# EAGLE design canable (EAGLE 6.6.0)
Therm
CNAME: CANable USB<=>CAN / FabLab Karlsruhe MOD; CREVISION: 0.1; DESIGNER: Ethan Zonca
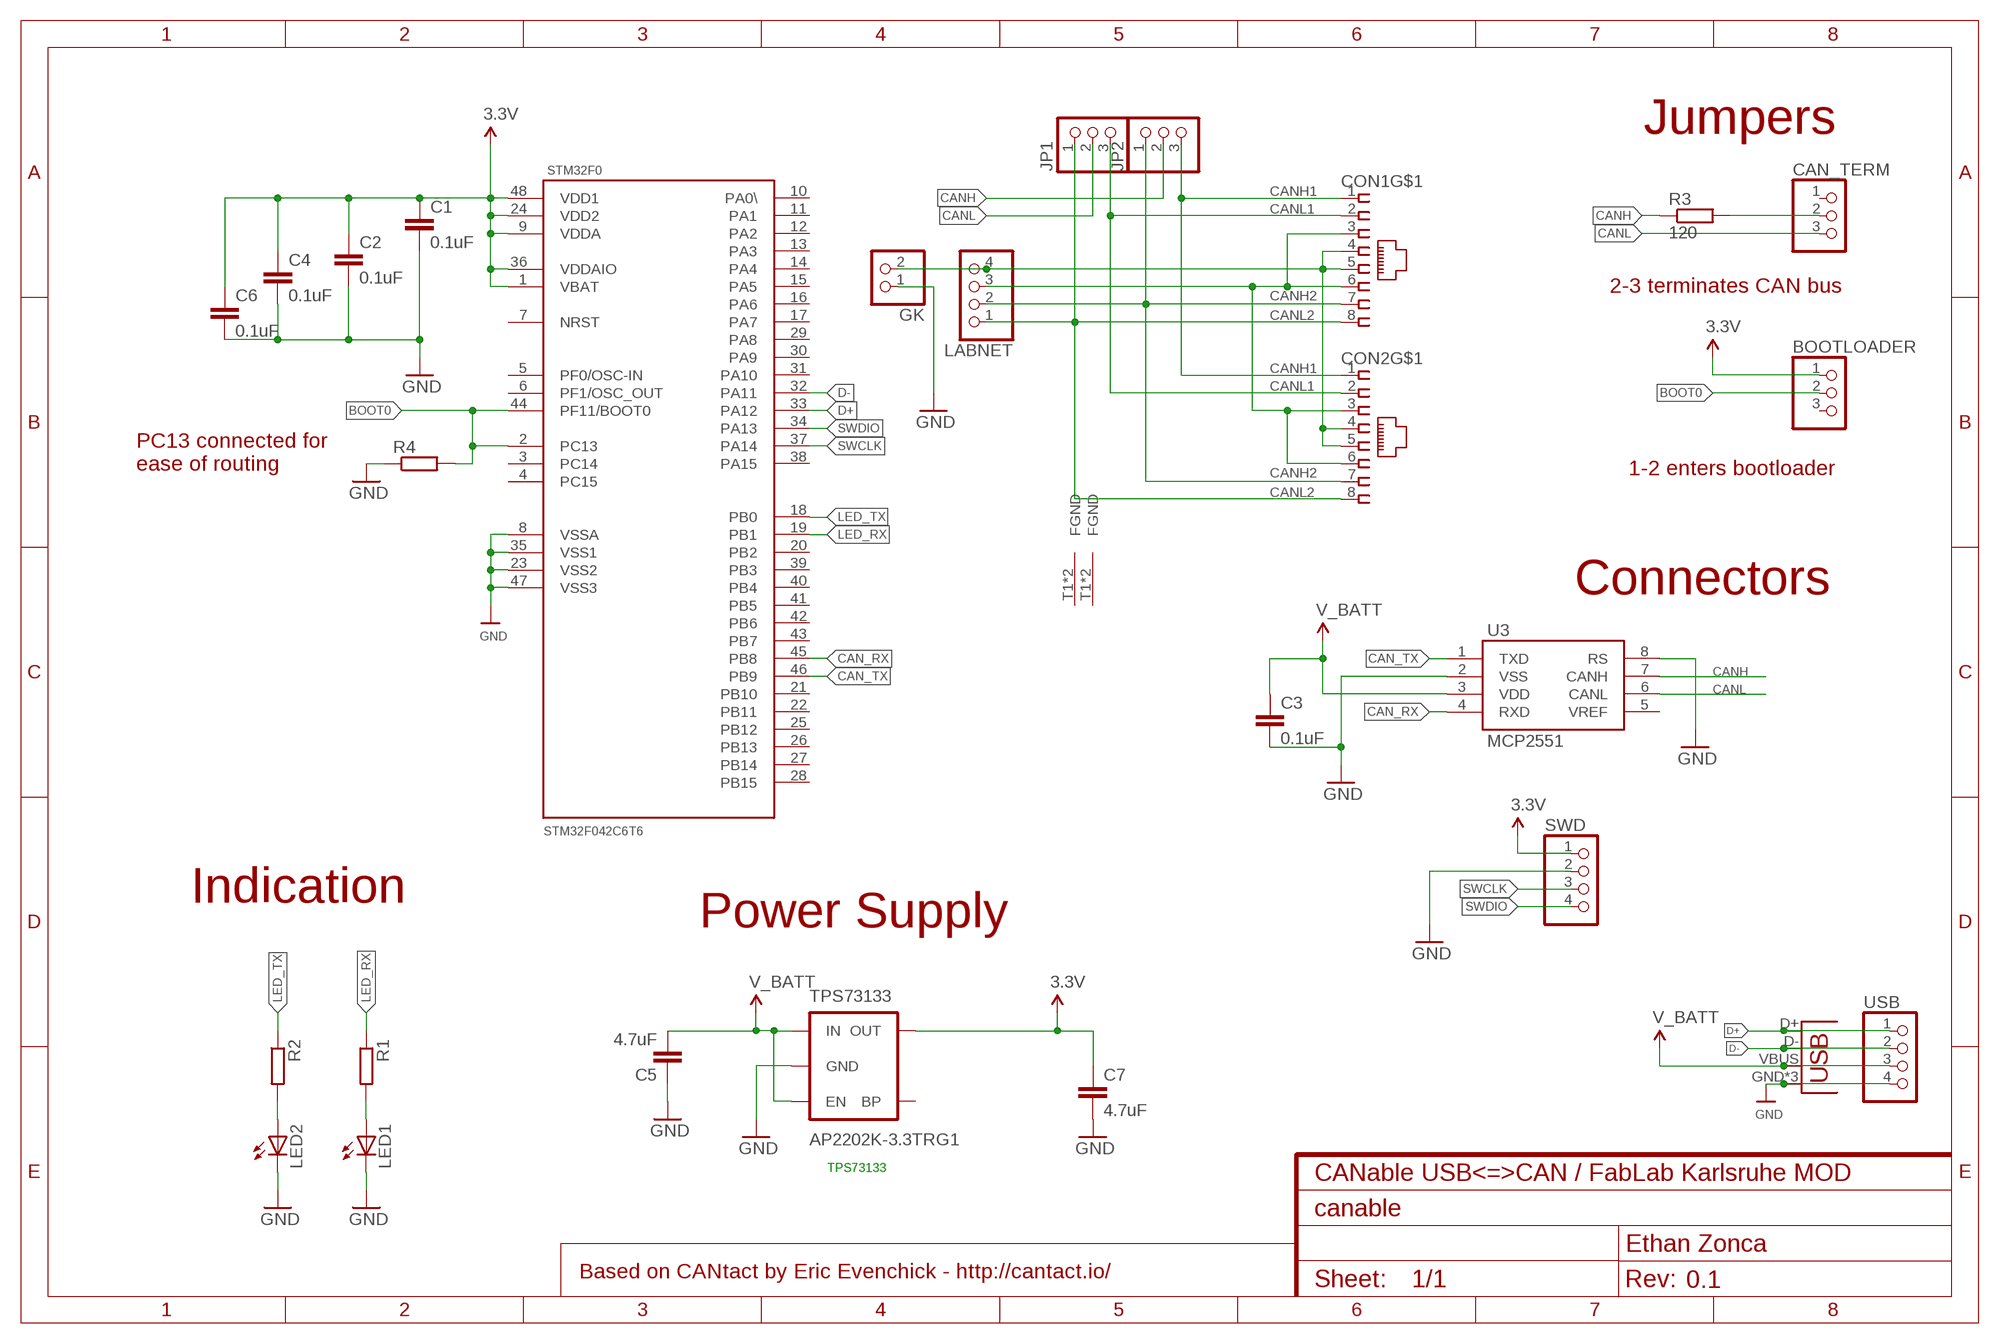
[diagram p0: schematic, sheet 1]

## Parts
BOOTLOADER  PINHD-1X3  [1X03]
C1  0.1uF  C-EUC0805  [C0805]
C2  0.1uF  C-EUC0805  [C0805]
C3  0.1uF  C-EUC0805  [C0805]
C4  0.1uF  C-EUC0805  [C0805]
C5  4.7uF  C-EUC0805  [C0805]
C6  0.1uF  C-EUC0805  [C0805]
C7  4.7uF  C-EUC0805  [C0805]
CAN_TERM  PINHD-1X3  [1X03]
CON1  MEBP_8-8G  [MEBP]
CON2  MEBP_8-8G  [MEBP]
GK  PINHD-1X2  [1X02]
J2  USB-MICROB  [USB-MICROB]
JP1  PINHD-1X3  [1X03]
JP2  PINHD-1X3  [1X03]
LABNET  PINHD-1X4  [1X04]
LED1  LEDCHIPLED_1206  [CHIPLED_1206]
LED2  LEDCHIPLED_1206  [CHIPLED_1206]
R1  R-EU_R0805  [R0805]
R2  R-EU_R0805  [R0805]
R3  120  R-EU_R0805  [R0805]
R4  R-EU_R0805  [R0805]
STM32F0  STM32F042C6T6  [LQFP48]
SWD  PINHD-1X4  [1X04]
TPS73133  AP2202K-3.3TRG1  MIC52053.3V  [SOT23-5]
U3  MCP2551  [SO08]
USB  PINHD-1X4  [1X04]

## Nets
3.3V: BOOTLOADER.1 C1.1 C2.1 C4.1 C6.1 C7.1 STM32F0.1(VBAT) STM32F0.9(VDDA) STM32F0.24(VDD2) STM32F0.36(VDDAIO) STM32F0.48(VDD1) SWD.1 TPS73133.5(OUT)
BOOT0: BOOTLOADER.2 R4.2 STM32F0.2(PC13) STM32F0.44(PF11/BOOT0)
CAN_RX: STM32F0.45(PB8) U3.4(RXD)
CAN_TX: STM32F0.46(PB9) U3.1(TXD)
CANH: JP2.2 R3.1 U3.7(CANH)
CANH1: CON1.1 CON2.1 JP2.3
CANH2: CON1.7 CON2.7 JP2.1 LABNET.2
CANL: CAN_TERM.3 JP1.2 U3.6(CANL)
CANL1: CON1.2 CON2.2 JP1.3
CANL2: CON1.8 CON2.8 JP1.1 LABNET.1
D+: J2.D+ STM32F0.33(PA12) USB.1
D-: J2.D- STM32F0.32(PA11) USB.2
GND: C1.2 C2.2 C3.2 C4.2 C5.1 C6.2 C7.2 GK.1 J2.GND J2.MT1(GND) J2.MT2(GND) LED1.C LED2.C R4.1 STM32F0.8(VSSA) STM32F0.23(VSS2) STM32F0.35(VSS1) STM32F0.47(VSS3) SWD.2 TPS73133.2(GND) U3.2(VSS) U3.8(RS) USB.4
LED_RX: R1.1 STM32F0.19(PB1)
LED_TX: R2.1 STM32F0.18(PB0)
N$2: LED2.A R2.2
N$3: CAN_TERM.2 R3.2
N$5: CON1.3 CON1.6 CON2.3 CON2.6 LABNET.3
N$6: CON1.4 CON1.5 CON2.4 CON2.5 GK.2 LABNET.4
N$23: LED1.A R1.2
SWCLK: STM32F0.37(PA14) SWD.3
SWDIO: STM32F0.34(PA13) SWD.4
V_BATT: C3.1 C5.2 J2.VBUS TPS73133.1(IN) TPS73133.3(EN) U3.3(VDD) USB.3
Unconnected: BOOTLOADER.3 CAN_TERM.1 STM32F0.3(PC14) STM32F0.4(PC15) STM32F0.5(PF0/OSC-IN) STM32F0.6(PF1/OSC_OUT) STM32F0.7(NRST) STM32F0.10(PA0\) STM32F0.11(PA1) STM32F0.12(PA2) STM32F0.13(PA3) STM32F0.14(PA4) STM32F0.15(PA5) STM32F0.16(PA6) STM32F0.17(PA7) STM32F0.20(PB2) STM32F0.21(PB10) STM32F0.22(PB11) STM32F0.25(PB12) STM32F0.26(PB13) STM32F0.27(PB14) STM32F0.28(PB15) STM32F0.29(PA8) STM32F0.30(PA9) STM32F0.31(PA10) STM32F0.38(PA15) STM32F0.39(PB3) STM32F0.40(PB4) STM32F0.41(PB5) STM32F0.42(PB6) STM32F0.43(PB7) TPS73133.4(BP) U3.5(VREF)

## Notes on the sheet
- Jumpers
- 2-3 terminates CAN bus
- 1-2 enters bootloader
- PC13 connected for
  ease of routing
- Connectors
- Indication
- Power Supply
- TPS73133
- Based on CANtact by Eric Evenchick - http://cantact.io/

## Power pins joined to a net without a drawn wire
FGND: CON1.T1(FGND) CON1.T2(FGND) CON2.T1(FGND) CON2.T2(FGND)

## Library data of the parts
BOOTLOADER CAN_TERM JP1 JP2 = pinhead:PINHD-1X3: PIN HEADER
C1-C7 = schlager_passiv:C-EU: CAPACITOR, European symbol
CON1 CON2 = schlager_con:MEBP_8-8G: Reichelt RJ45 geschirmt MEBP 8-8G
GK = pinhead:PINHD-1X2: PIN HEADER
J2 = SparkFun-Connectors:USB: USB Connectors USB-B-PTH is fully proven SKU : PRT-00139/CONN-08278 USB-miniB is fully proven SKU : PRT-00587 USB-A-PCB is untested. USB-A-H is throughly reviewed, but untested. Spark Fun Electronics SKU : PRT-00437 USB-B-SMT is throughly reviewed, but untested. Needs silkscreen touching up. USB-A-S has not been used/tested USB-MB-H has not been used/tested USB-MICROB has been used. CONN-09505; PROD_ID: CONN-09505
LABNET SWD USB = pinhead:PINHD-1X4: PIN HEADER
LED1 LED2 = led:LED: LED OSRAM: - CHIPLED LG R971, LG N971, LY N971, LG Q971, LY Q971, LO R971, LY R971 LH N974, LH R974 LS Q976, LO Q976, LY Q976 LO Q996 - Hyper CHIPLED LW Q18S LB Q993, LB Q99A, LB R99A - SideLED LS A670, LO A670, LY A670, LG A670, LP A670 LB A673, LV A673, LT A673, LW A673 LH A674 LY A675 LS A676, LA A676, LO A676, LY A676, LW A676 LS A679, LY A679, LG A679 - Hyper Micro SIDELED® LS Y876, LA Y876, LO Y876, LY Y876 LT Y87S - SmartLED LW L88C, LW L88S LB L89C, LB L89S, LG L890 LS L89K, LO L89K, LY L89K LS L896, LA L896, LO L896, LY L896 - TOPLED LS T670, LO T670, LY T670, LG T670, LP T670 LSG T670, LSP T670, LSY T670, LOP T670, LYG T670 LG T671, LOG T671, LSG T671 LB T673, LV T673, LT T673, LW T673 LH T674 LS T676, LA T676, LO T676, LY T676, LB T676, LH T676, LSB T676, LW T676 LB T67C, LV T67C, LT T67C, LS T67K, LO T67K, LY T67K, LW E67C LS E67B, LA E67B, LO E67B, LY E67B, LB E67C, LV E67C, LT E67C LW T67C LS T679, LY T679, LG T679 LS T770, LO T770, LY T770, LG T770, LP T770 LB T773, LV T773, LT T773, LW T773 LH T774 LS E675, LA E675, LY E675, LS T675 LS T776, LA T776, LO T776, LY T776, LB T776 LHGB T686 LT T68C, LB T68C - Hyper Mini TOPLED® LB M676 - Mini TOPLED Santana® LG M470 LS M47K, LO M47K, LY M47K Source: http://www.osram.convergy.de LUXEON: - LUMILED® LXK2-PW12-R00, LXK2-PW12-S00, LXK2-PW14-U00, LXK2-PW14-V00 LXK2-PM12-R00, LXK2-PM12-S00, LXK2-PM14-U00 LXK2-PE12-Q00, LXK2-PE12-R00, LXK2-PE12-S00, LXK2-PE14-T00, LXK2-PE14-U00 LXK2-PB12-K00, LXK2-PB12-L00, LXK2-PB12-M00, LXK2-PB14-N00, LXK2-PB14-P00, LXK2-PB14-Q00 LXK2-PR12-L00, LXK2-PR12-M00, LXK2-PR14-Q00, LXK2-PR14-R00 LXK2-PD12-Q00, LXK2-PD12-R00, LXK2-PD12-S00 LXK2-PH12-R00, LXK2-PH12-S00 LXK2-PL12-P00, LXK2-PL12-Q00, LXK2-PL12-R00 Source: www.luxeon.com KINGBRIGHT: KA-3528ASYC Source: www.kingbright.com
R1-R4 = schlager_passiv:R-EU_: RESISTOR, European symbol
STM32F0 = Protofusion:STM32F042C6T6
TPS73133 = SparkFun-PowerIC:MIC5205: MIC5205 150mA vreg 3.3V - VREG-00822 5V - VREG-00823; PROD_ID: VREG-00822
U3 = SparkFun-DigitalIC:MCP2551: CAN transceiver; PROD_ID: IC-09907

## Board
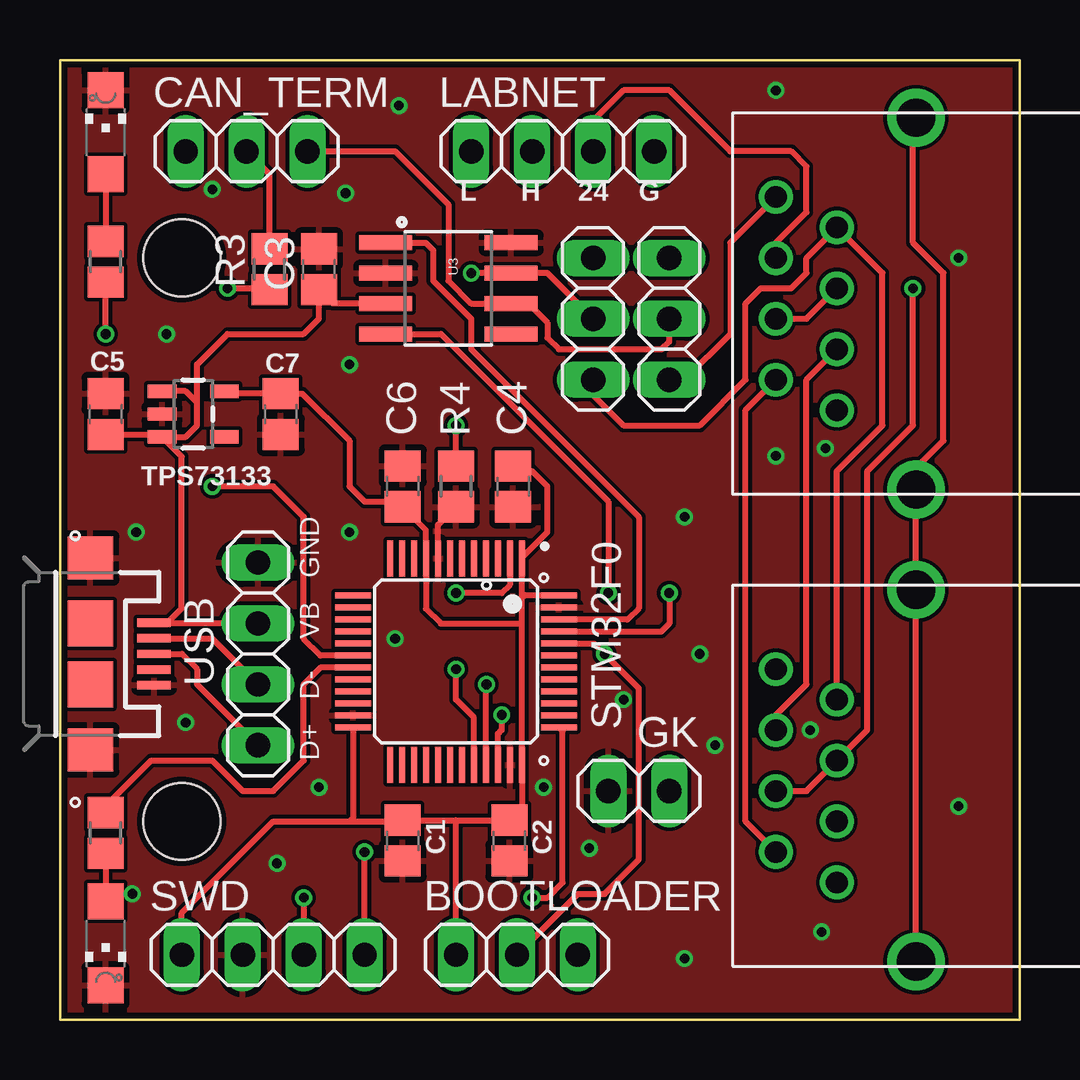
[diagram p1: board, top side]
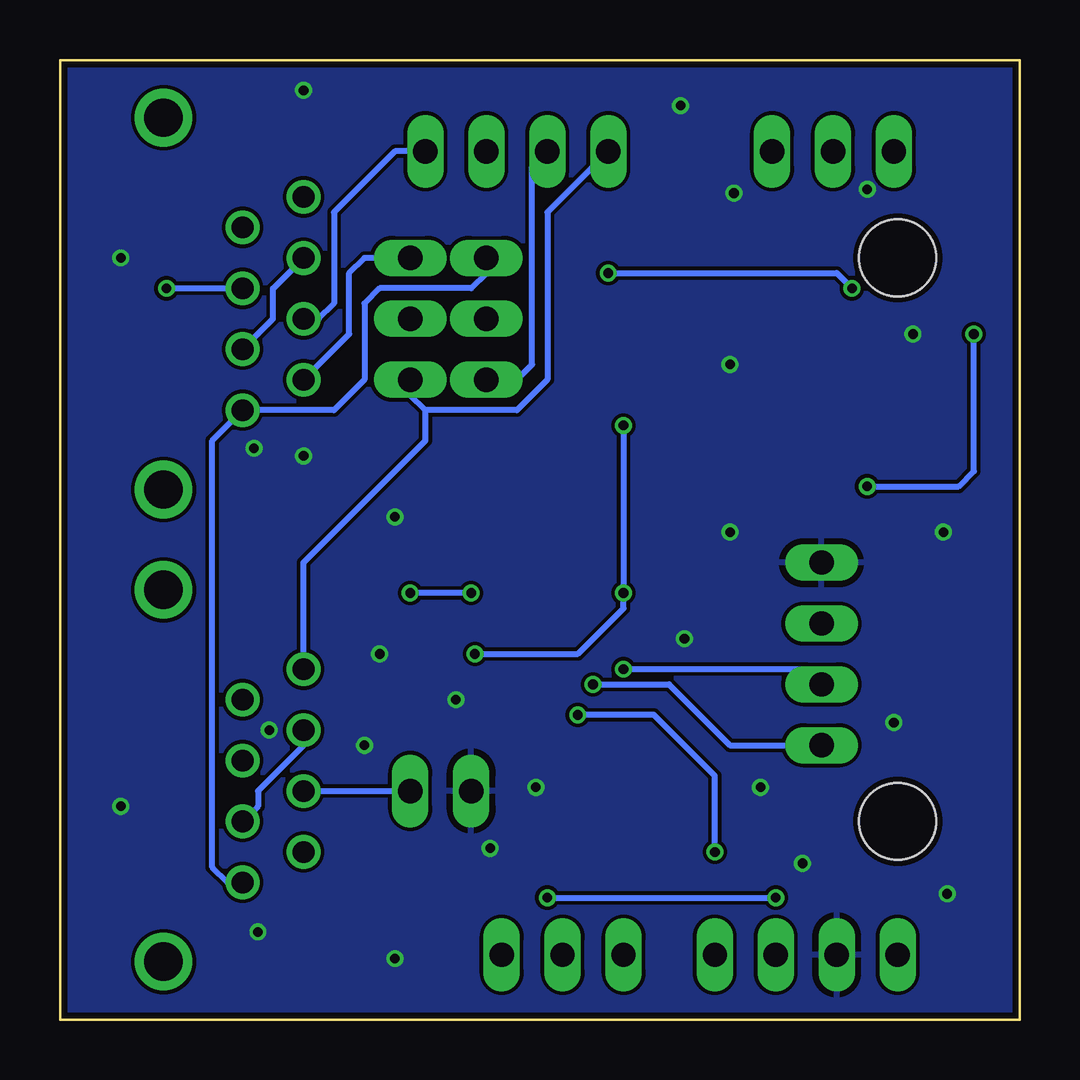
[diagram p2: board, bottom side, seen from below]

Size 40 x 40 mm. Coordinates in mm from the lower left corner, seen from the top.
Outline: 0,0 0,40 40,40 40,0 0,0
Copper layers (1*16): Top 0.035mm / dielectric 1.5mm / Bottom 0.035mm
Design rules "Elecrow_2-layer_eagle_rule *": minimum track width 6mil, minimum drill 12mil, track to track 6mil, track to pad 6mil, pad to pad 6mil, via to via 6mil, smd to smd 0mil, copper to edge 10mil, drill to drill 10mil, minimum pad ring 10mil, minimum via ring 6mil, stop-mask expansion 2mil, vias tented up to drill 100mil, thermal gap 10mil
Holes 3.2 mm at 5.08,31.75 5.08,8.26

### Footprints (pad centres in the part's own frame; a part is rotated, then mirrored left to right if it is on the bottom)
1X03 = drill 1.016 long: 1 -2.54,0; 2 0,0; 3 2.54,0
C0805 = smd 1.3 x 1.5: 1 -0.85,0; 2 0.85,0
MEBP = drill 0.9: 1 -4.445,6.35; 2 -3.175,8.89; 3 -1.9,6.35; 4 -0.635,8.89; 5 0.635,6.35; 6 1.9,8.89; 7 3.175,6.35; 8 4.445,8.89 | drill 1.6: T1 -7.75,3.05; T2 7.75,3.05
1X02 = drill 1.016 long: 1 -1.27,0; 2 1.27,0
USB-MICROB = smd 0.35 x 1.4: D+ 0,2.65; D- -0.65,2.65; GND 1.3,2.65; ID 0.65,2.65; VBUS -1.3,2.65 | smd 1.8 x 1.9: MT1 -4,0; MT2 4,0 | smd 1.9 x 1.9: P$1 -1.27,0; P$2 1.27,0
1X04 = drill 1.016 long: 1 -3.81,0; 2 -1.27,0; 3 1.27,0; 4 3.81,0
CHIPLED_1206 = smd 1.5 x 1.5: A 0,-1.75; C 0,1.75
R0805 = smd 1.3 x 1.5: 1 -0.85,0; 2 0.85,0
LQFP48 = smd 1.5 x 0.25: 1 -4.3,2.75; 2 -4.3,2.25; 3 -4.3,1.75; 4 -4.3,1.25; 5 -4.3,0.75; 6 -4.3,0.25; 7 -4.3,-0.25; 8 -4.3,-0.75; 9 -4.3,-1.25; 10 -4.3,-1.75; 11 -4.3,-2.25; 12 -4.3,-2.75; 25 4.3,-2.75; 26 4.3,-2.25; 27 4.3,-1.75; 28 4.3,-1.25; 29 4.3,-0.75; 30 4.3,-0.25; 31 4.3,0.25; 32 4.3,0.75; 33 4.3,1.25; 34 4.3,1.75; 35 4.3,2.25; 36 4.3,2.75 | smd 0.25 x 1.5: 13 -2.75,-4.3; 14 -2.25,-4.3; 15 -1.75,-4.3; 16 -1.25,-4.3; 17 -0.75,-4.3; 18 -0.25,-4.3; 19 0.25,-4.3; 20 0.75,-4.3; 21 1.25,-4.3; 22 1.75,-4.3; 23 2.25,-4.3; 24 2.75,-4.3; 37 2.75,4.3; 38 2.25,4.3; 39 1.75,4.3; 40 1.25,4.3; 41 0.75,4.3; 42 0.25,4.3; 43 -0.25,4.3; 44 -0.75,4.3; 45 -1.25,4.3; 46 -1.75,4.3; 47 -2.25,4.3; 48 -2.75,4.3
SOT23-5 = smd 0.55 x 1.2: 1 -0.95,-1.3; 2 0,-1.3; 3 0.95,-1.3; 4 0.95,1.3; 5 -0.95,1.3
SO08 = smd 0.61 x 2.21: 1 -1.905,-2.616; 2 -0.635,-2.616; 3 0.635,-2.616; 4 1.905,-2.616; 5 1.905,2.616; 6 0.635,2.616; 7 -0.635,2.616; 8 -1.905,2.616

### Placement (x,y rotation side)
BOOTLOADER  19.05,2.7 0 top
C1  14.29,7.46 270 top
C2  18.73,7.46 270 top
C3  10.79,31.27 90 top
C4  18.89,22.23 270 top
C5  1.91,25.24 270 top
C6  14.29,22.23 90 top
C7  9.21,25.24 270 top
CAN_TERM  7.78,36.2 0 top
CON1  38.73,29.84 90 top
CON2  38.73,10.16 90 top
GK  24.13,9.53 0 top
J2  1.27,15.24 270 top
JP1  25.4,29.21 90 top
JP2  22.23,29.21 90 top
LABNET  20.95,36.2 0 top
LED1  1.91,3.17 180 top
LED2  1.91,36.99 0 top
R1  1.91,7.78 270 top
R2  1.91,31.59 90 top
R3  8.73,31.27 90 top
R4  16.51,22.23 90 top
STM32F0  16.51,14.92 270 top
SWD  8.89,2.7 0 top
TPS73133  5.56,25.24 270 top
U3  16.19,30.48 270 top
USB  8.26,15.24 90 top

### Tracks (layer width: path | path; a pad name or v marks a point on that pad's centre or on a via)
3.3V
  Top 0.254: SWD.1 5.08,4.45 8.89,8.26 12.06,8.26 | 12.06,8.26 14.23,8.26 C1.1 16.51,8.31 | 16.51,8.31 C2.1 19.26,8.84 STM32F0.36 19.26,16.51 | STM32F0.24 12.21,8.4 12.06,8.26 | BOOTLOADER.1 16.51,8.31 | 19.26,16.51 19.26,17.78 | 19.26,17.78 STM32F0.1 19.26,19.26 20.32,20.32 20.32,22.23 19.68,22.86 19.11,22.86 C4.1 | 19.26,16.51 15.88,16.51 15.26,17.12 STM32F0.9 15.26,20.4 C6.1 14.07,21.59 12.7,21.59 12.06,22.23 12.06,24.13 10.1,26.09 C7.1 6.96,26.09 TPS73133.5 | STM32F0.48 19.37,17.67 19.26,17.78
BOOT0  (via drill 0.4)
  Top 0.254: R4.2 v16.51,24.77 | STM32F0.2 18.76,18.12 18.41,17.78 v16.51,17.78 | STM32F0.44 22.27,15.67 v22.7,15.24 24.13,13.81 24.13,6.67 22.7,5.24 21.59,5.24 BOOTLOADER.2
  Bottom 0.254: v16.51,24.77 v16.51,17.78 16.51,17.14 18.41,15.24 v22.7,15.24
CAN_RX  (via drill 0.4)
  Top 0.254: U3.4 15.88,28.57 22.86,21.59 v22.86,17.78 | v25.4,17.78 25.4,16.51 25.06,16.17 STM32F0.45
  Bottom 0.254: v22.86,17.78 v25.4,17.78
CAN_TX
  Top 0.254: U3.1 15.24,32.38 15.56,32.07 15.56,30.8 17.14,29.21 17.14,27.94 24.13,20.95 24.13,17.14 23.65,16.67 STM32F0.46
CANH  (via drill 0.4)
  Top 0.254: JP2.2 20.32,31.11 U3.7 v17.14,31.11 | v6.99,30.48 8.68,30.48 R3.1
  Bottom 0.254: v17.14,31.11 7.62,31.11 v6.99,30.48
CANH1
  Bottom 0.254: JP2.3 22.23,31.11 22.86,30.48 26.67,30.48 27.3,29.84 27.3,26.67 28.57,25.4 CON1.1 33.66,24.13 33.66,6.35 33.02,5.71 CON2.1
CANH2
  Top 0.254: JP2.1 22.23,26.04 23.5,24.77 26.67,24.77 28.57,26.67 28.57,29.84 29.21,30.48 30.48,30.48 31.11,31.11 31.11,31.75 CON1.7 34.29,31.11 34.29,24.77 32.38,22.86 CON2.7
  Bottom 0.254: JP2.1 20.95,26.67 20.32,27.3 20.32,35.56 LABNET.2
CANL
  Top 0.254: JP1.2 25.4,28.26 25.08,27.94 20.8,27.94 20.32,28.42 20.32,29.05 19.53,29.84 U3.6 17.14,29.84 16.19,30.8 16.19,33.97 13.97,36.2 CAN_TERM.3
CANL1
  Top 0.254: CON2.2 28.57,8.26 28.57,25.4 CON1.2
  Bottom 0.254: JP1.3 27.3,31.75 27.94,31.11 27.94,28.57 CON1.2
CANL2
  Top 0.254: JP1.1 26.04,26.67 27.94,28.57 27.94,32.38 CON1.8
  Bottom 0.254: 24.77,25.4 20.95,25.4 19.68,26.67 19.68,33.66 LABNET.1 | 24.77,25.4 25.4,26.04 JP1.1 | CON2.8 29.84,19.05 24.77,24.13 24.77,25.4
D+  (via drill 0.4)
  Top 0.254: STM32F0.33 17.76,13.95 v17.78,13.97 | J2.D+ 5.08,15.24 5.71,14.61 5.71,13.97 USB.1
  Bottom 0.254: v17.78,13.97 14.61,13.97 12.06,11.43 USB.1
D-  (via drill 0.4)
  Top 0.254: STM32F0.32 17.26,12.59 16.51,13.34 v16.51,14.61 | J2.D- 6.33,15.89 USB.2
  Bottom 0.254: v16.51,14.61 8.89,14.61 USB.2
FGND
  Top 0.254: CON2.T1 CON2.T2 CON1.T1 35.69,22.98 36.83,24.13 36.83,31.11 35.56,32.38 35.56,37.47 CON1.T2
GND  (via drill 0.4)
  Top 0.254: STM32F0.8 15.76,20.62 R4.1
  other vias: 4.45,28.57 12.06,27.3 3.17,20.32 12.06,20.32 13.97,15.88 26.04,2.54 27.3,11.43 26.67,15.24 26.04,20.95 23.5,13.34 37.47,8.89 37.47,31.75 29.84,38.73 29.84,23.5 31.91,23.81 31.27,12.06 9.05,6.51 10.79,9.68 3.02,5.24 5.24,12.38 20.16,9.68 31.75,3.65 11.91,34.45 14.13,38.1 6.35,34.61 22.07,7.14
  pour Bottom: 0,44.45 68.58,44.45 68.58,-3.81 0,-3.81
  pour Top: -1.27,-0.64 71.12,-0.64 71.12,46.99 -1.27,46.99
LED_RX
  Top 0.254: R1.1 1.64,8.63 3.81,10.79 6.35,10.79 7.62,9.53 8.89,9.53 10.16,10.79 10.16,13.97 10.86,14.67 STM32F0.19
LED_TX  (via drill 0.4)
  Top 0.254: STM32F0.18 10.86,15.17 10.16,15.88 10.16,20.95 8.89,22.23 v6.35,22.23 | v1.91,28.57 R2.1
  Bottom 0.254: v6.35,22.23 2.54,22.23 1.91,22.86 v1.91,28.57
N$2
  Top 0.254: LED2.A R2.2
N$3
  Top 0.254: R3.2 8.73,35.24 CAN_TERM.2
N$5
  Top 0.254: CON1.6 29.84,32.38 31.11,33.66 31.11,35.56 30.48,36.2 27.94,36.2 25.4,38.73 23.5,38.73 22.23,37.47 LABNET.3 | CON2.6 29.84,12.7 31.11,13.97 31.11,26.68 CON1.3
  Bottom 0.254: CON2.6 29.84,11.43 31.75,9.53 31.75,8.89 CON2.3 | CON1.3 31.11,29.21 31.11,30.48 CON1.6
N$6  (via drill 0.4)
  Top 0.254: CON2.4 31.11,9.53 CON2.5 33.66,12.06 33.66,22.86 35.56,24.77 v35.56,30.48 | CON1.4 31.11,29.21 CON1.5
  Bottom 0.254: CON1.4 29.21,29.21 28.57,29.84 28.57,33.66 26.04,36.2 LABNET.4 | v35.56,30.48 CON1.5 | CON2.4 GK.2
N$23
  Top 0.254: R1.2 LED1.A
SWCLK  (via drill 0.4)
  Top 0.254: v10.16,5.08 SWD.3 | v19.68,5.08 20.32,5.08 20.95,5.71 20.95,12.03 STM32F0.37
  Bottom 0.254: v19.68,5.08 v10.16,5.08
SWDIO  (via drill 0.4)
  Top 0.254: SWD.4 v12.7,6.99 | v18.41,12.7 18.41,12.06 18.26,11.91 STM32F0.34
  Bottom 0.254: v12.7,6.99 12.7,10.16 15.24,12.7 v18.41,12.7
V_BATT
  Top 0.254: USB.3 8.22,16.54 J2.VBUS 4.47,16.54 5.08,17.14 5.08,23.47 TPS73133.3 | C5.2 4.16,24.39 TPS73133.3 | TPS73133.3 5.24,24.29 5.71,24.77 5.71,25.72 | 5.71,25.72 5.24,26.19 TPS73133.1 | 5.71,25.72 5.71,27.3 6.99,28.57 10.16,28.57 10.79,29.21 C3.1 11.37,29.84 U3.3

### Text on the board
tPlace: L | H | 24 | G | GND | VB | D- | D+